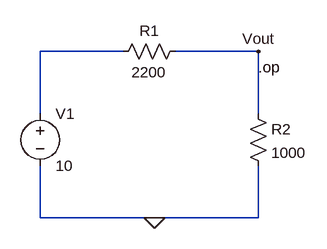
[diagram p0: schematic Divisor_de_tension.asc]
Divisor_de_tension.asc, the LTspice schematic file:
Version 4
SHEET 1 880 680
WIRE 512 -432 384 -432
WIRE 720 -432 592 -432
WIRE 384 -336 384 -432
WIRE 720 -336 720 -432
WIRE 384 -176 384 -256
WIRE 560 -176 384 -176
WIRE 720 -176 720 -256
WIRE 720 -176 560 -176
FLAG 560 -176 0
FLAG 720 -432 Vout
SYMBOL res 496 -416 R270
WINDOW 0 32 56 VTop 2
WINDOW 3 0 56 VBottom 2
SYMATTR InstName R1
SYMATTR Value 2200
SYMBOL res 704 -352 R0
SYMATTR InstName R2
SYMATTR Value 1000
SYMBOL voltage 384 -352 R0
WINDOW 123 0 0 Left 2
WINDOW 39 0 0 Left 2
SYMATTR InstName V1
SYMATTR Value 10
TEXT 720 -408 Left 2 !.op

The netlist it stands for:
* Divisor_de_tension.asc
R1 N001 Vout 2200
R2 Vout 0 1000
V1 N001 0 10
.op
.backanno
.end